# Altium schematic sheet MC34063.SchDoc
size A4
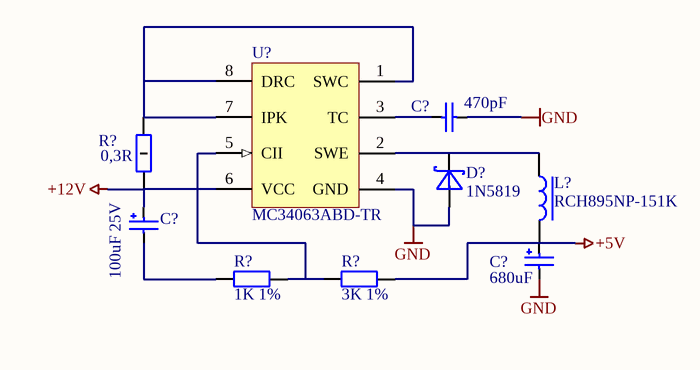
[diagram p0: MC34063.SchDoc]

## Parts
(Parts that share a designator on the sheet are numbered #1, #2 ... from top to bottom, then left to right.)
C?#1  value 470pF  [C_1206]  (hidden comment: Cap_Semi)
C?#2  value 100uF 25V  [8x11]  (hidden comment: Capacitor Polar)
C?#3  value 680uF  [10x16]  (hidden comment: Capacitor Polar)
D?  1N5819  [DO-41_6mm]
L?  RCH895NP-151K  [RCH-895]
R?#1  value 0,3R  [Resistor 1W_Vertical]  (hidden comment: Resistor 1W)
R?#2  value 1K 1%  [R_1206]  (hidden comment: Resistor 1206)
R?#3  value 3K 1%  [R_1206]  (hidden comment: Resistor 1206)
U?  MC34063ABD-TR  [SO-8_N]

## Nets
+5V: C?#3.1 L?.1 R?#3.2
+12V: C?#2.1 R?#1.1 U?.6(VCC)
GND: C?#1.2 C?#3.2 D?.1(A) U?.4(GND)
NetC?#1_1: C?#1.1 U?.3(TC)
NetC?#2_2: C?#2.2 R?#2.1
NetD?_2: D?.2(C) L?.2 U?.2(SWE)
NetR?#1_2: R?#1.2 U?.1(SWC) U?.7(IPK) U?.8(DRC)
NetR?#2_2: R?#2.2 R?#3.1 U?.5(CII)

## Library data of the parts
C?#1 = Cap_Semi: Capacitor semi
D? = 1N5819: Diode Schottky
L? = Induction
U? = MC34063ABD-TR: DC/DC converter control circuit, 8-Pin SO, Tape and Reel; DatasheetVersion: Nov-2007; PackageVersion: Dec-2002; PackageReference: SO8; PackageDescription: 8-Pin Small Outline Integrated Circuit 1.27 mm Pitch; Code_JEDEC: MS-012-AA; Code_IPC: SOIC127P600-8; ComponentLink1Description: Manufacturer URL; ComponentLink1URL: http://www.st.com; ComponentLink2Description: Datasheet; ComponentLink2URL: http://www.st.com/internet/com/TECHNICAL_RESOURCES/TECHNICAL_LITERATURE/DATASHEET/CD00001232.pdf; ComponentLink3Description: Package Specification; ComponentLink3URL: http://www.st.com/internet/com/TECHNICAL_RESOURCES/TECHNICAL_LITERATURE/PACKAGE_INFORMATION/CD00004680.pdf